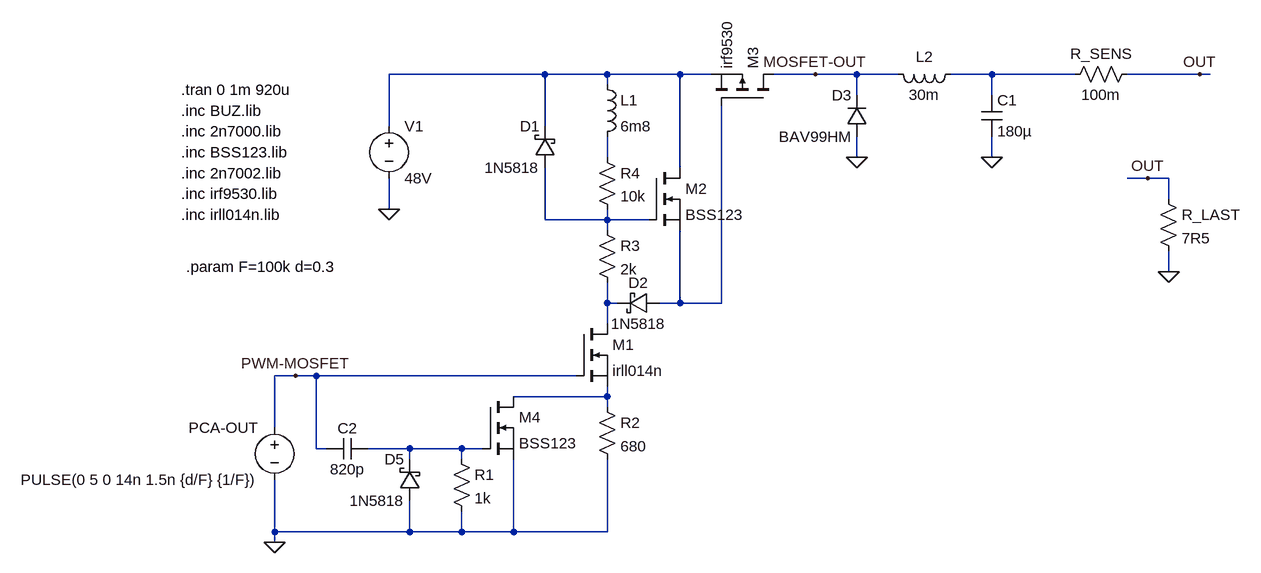
[diagram p0: schematic Hauptlichtsteuerung_einfach.asc]
Hauptlichtsteuerung_einfach.asc, the LTspice schematic file:
Version 4
SHEET 1 2276 2660
WIRE -400 32 -640 32
WIRE -304 32 -400 32
WIRE -192 32 -304 32
WIRE -144 32 -192 32
WIRE 16 32 -48 32
WIRE 80 32 16 32
WIRE 144 32 80 32
WIRE 288 32 224 32
WIRE 416 32 288 32
WIRE 608 32 496 32
WIRE 624 32 608 32
WIRE -304 48 -304 32
WIRE 80 64 80 32
WIRE 288 64 288 32
WIRE -640 112 -640 32
WIRE -400 112 -400 32
WIRE -304 160 -304 128
WIRE 80 160 80 128
WIRE 288 160 288 128
WIRE -192 176 -192 32
WIRE 528 192 496 192
WIRE 560 192 528 192
WIRE 560 224 560 192
WIRE -640 240 -640 192
WIRE -400 256 -400 176
WIRE -304 256 -304 240
WIRE -304 256 -400 256
WIRE -240 256 -304 256
WIRE -304 272 -304 256
WIRE 560 336 560 304
WIRE -304 384 -304 352
WIRE -288 384 -304 384
WIRE -192 384 -192 272
WIRE -192 384 -224 384
WIRE -128 384 -128 80
WIRE -128 384 -192 384
WIRE -304 416 -304 384
WIRE -784 496 -816 496
WIRE -752 496 -784 496
WIRE -352 496 -752 496
WIRE -304 528 -304 512
WIRE -304 528 -448 528
WIRE -304 544 -304 528
WIRE -816 576 -816 496
WIRE -752 608 -752 496
WIRE -736 608 -752 608
WIRE -608 608 -672 608
WIRE -528 608 -608 608
WIRE -496 608 -528 608
WIRE -608 624 -608 608
WIRE -528 624 -528 608
WIRE -816 736 -816 656
WIRE -608 736 -608 688
WIRE -608 736 -816 736
WIRE -528 736 -528 704
WIRE -528 736 -608 736
WIRE -448 736 -448 624
WIRE -448 736 -528 736
WIRE -304 736 -304 624
WIRE -304 736 -448 736
WIRE -816 752 -816 736
FLAG 80 160 0
FLAG 288 160 0
FLAG -784 496 PWM-MOSFET
FLAG 16 32 MOSFET-OUT
FLAG 608 32 OUT
FLAG 560 336 0
FLAG 528 192 OUT
FLAG -640 240 0
FLAG -816 752 0
SYMBOL nmos -352 416 R0
SYMATTR InstName M1
SYMATTR Value irll014n
SYMATTR Prefix X
SYMBOL nmos -240 176 R0
SYMATTR InstName M2
SYMATTR Value BSS123
SYMATTR Prefix X
SYMBOL res -320 528 R0
SYMATTR InstName R2
SYMATTR Value 680
SYMBOL cap -672 592 R90
WINDOW 0 0 32 VBottom 2
WINDOW 3 32 32 VTop 2
SYMATTR InstName C2
SYMATTR Value 820p
SYMBOL res -320 256 R0
SYMATTR InstName R3
SYMATTR Value 2k
SYMBOL res -320 144 R0
SYMATTR InstName R4
SYMATTR Value 10k
SYMBOL ind -320 32 R0
SYMATTR InstName L1
SYMATTR Value 6m8
SYMBOL pmos -48 80 M270
SYMATTR InstName M3
SYMATTR Value irf9530
SYMATTR Prefix X
SYMBOL voltage -640 96 R0
WINDOW 123 0 0 Left 2
WINDOW 39 0 0 Left 2
SYMATTR InstName V1
SYMATTR Value 48V
SYMBOL ind 240 16 R90
WINDOW 0 5 56 VBottom 2
WINDOW 3 32 56 VTop 2
SYMATTR InstName L2
SYMATTR Value 30m
SYMBOL cap 272 64 R0
SYMATTR InstName C1
SYMATTR Value 180µ
SYMBOL diode 96 128 R180
WINDOW 0 24 64 Left 2
WINDOW 3 24 0 Left 2
SYMATTR InstName D3
SYMATTR Value BAV99HM
SYMBOL res 544 208 R0
SYMATTR InstName R_LAST
SYMATTR Value 7R5
SYMBOL res 512 16 R90
WINDOW 0 0 56 VBottom 2
WINDOW 3 32 56 VTop 2
SYMATTR InstName R_SENS
SYMATTR Value 100m
SYMBOL voltage -816 560 M0
WINDOW 123 0 0 Left 2
WINDOW 39 0 0 Left 2
SYMATTR InstName PCA-OUT
SYMATTR Value PULSE(0 5 0 14n 1.5n {d/F} {1/F})
SYMBOL res -544 608 R0
SYMATTR InstName R1
SYMATTR Value 1k
SYMBOL nmos -496 528 R0
SYMATTR InstName M4
SYMATTR Value BSS123
SYMATTR Prefix X
SYMBOL schottky -592 688 R180
WINDOW 0 24 64 Left 2
WINDOW 3 24 0 Left 2
SYMATTR InstName D5
SYMATTR Value 1N5818
SYMATTR Description Diode
SYMATTR Type diode
SYMBOL schottky -384 176 R180
WINDOW 0 24 64 Left 2
WINDOW 3 24 0 Left 2
SYMATTR InstName D1
SYMATTR Value 1N5818
SYMATTR Description Diode
SYMATTR Type diode
SYMBOL schottky -224 368 R90
WINDOW 0 0 32 VBottom 2
WINDOW 3 32 32 VTop 2
SYMATTR InstName D2
SYMATTR Value 1N5818
SYMATTR Description Diode
SYMATTR Type diode
TEXT -960 56 Left 2 !.tran 0 1m 920u
TEXT -960 88 Left 2 !.inc BUZ.lib
TEXT -960 120 Left 2 !.inc 2n7000.lib
TEXT -952 328 Left 2 !.param F=100k d=0.3
TEXT -960 152 Left 2 !.inc BSS123.lib
TEXT -960 184 Left 2 !.inc 2n7002.lib
TEXT -960 216 Left 2 !.inc irf9530.lib
TEXT -960 248 Left 2 !.inc irll014n.lib

The netlist it stands for:
* Hauptlichtsteuerung_einfach.asc
XM1 N005 PWM-MOSFET N007 irll014n  ; pins D G S
XM2 N001 N004 N006 BSS123  ; pins D G S
R2 N007 0 680
C2 N008 PWM-MOSFET 820p
R3 N004 N005 2k
R4 N003 N004 10k
L1 N001 N003 6m8
XM3 MOSFET-OUT N006 N001 irf9530  ; pins D G S
V1 N001 0 48V
L2 N002 MOSFET-OUT 30m
C1 N002 0 180µ
D3 0 MOSFET-OUT BAV99HM
R_LAST OUT 0 7R5
R_SENS OUT N002 100m
V§PCA-OUT PWM-MOSFET 0 PULSE(0 5 0 14n 1.5n {d/F} {1/F})
R1 N008 0 1k
XM4 N007 N008 0 BSS123  ; pins D G S
D5 0 N008 1N5818
D1 N004 N001 1N5818
D2 N006 N005 1N5818
.model D D
.lib standard.dio
.tran 0 1m 920u
.inc BUZ.lib
.inc 2n7000.lib
.param F=100k d=0.3
.inc BSS123.lib
.inc 2n7002.lib
.inc irf9530.lib
.inc irll014n.lib
.backanno
.end